# EAGLE schematic G22V2 (EAGLE 9.6.2)
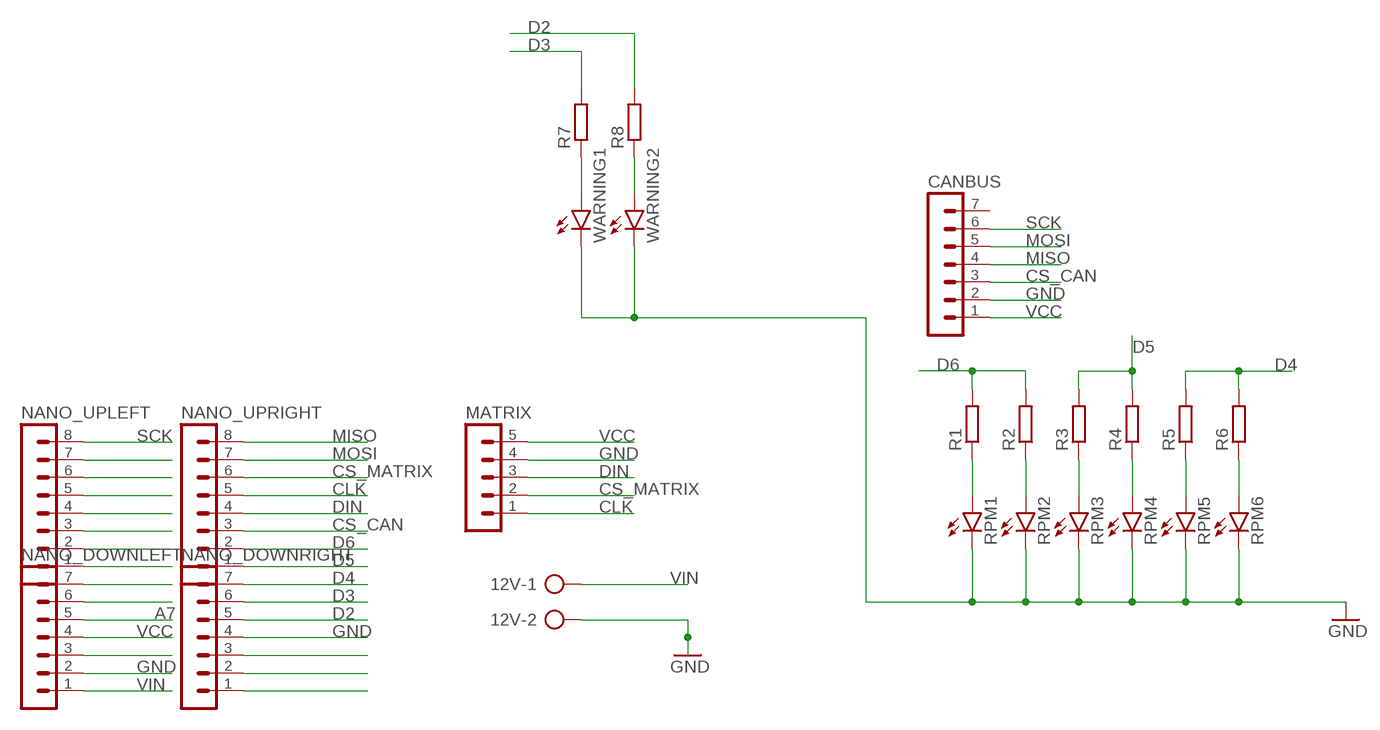
[diagram p0: schematic, sheet 1]

## Parts
12V  AK500/2-H  [AK500/2-H]
CANBUS  MA07-1  [MA07-1]
MATRIX  MA05-1  [MA05-1]
NANO_DOWNLEFT  MA07-1  [MA07-1]
NANO_DOWNRIGHT  MA07-1  [MA07-1]
NANO_UPLEFT  MA08-1  [MA08-1]
NANO_UPRIGHT  MA08-1  [MA08-1]
R1  R-EU_0204/7  [0204/7]
R2  R-EU_0204/7  [0204/7]
R3  R-EU_0204/7  [0204/7]
R4  R-EU_0204/7  [0204/7]
R5  R-EU_0204/7  [0204/7]
R6  R-EU_0204/7  [0204/7]
R7  R-EU_0204/7  [0204/7]
R8  R-EU_0204/7  [0204/7]
RPM1  LED5MM  [LED5MM]
RPM2  LED5MM  [LED5MM]
RPM3  LED5MM  [LED5MM]
RPM4  LED5MM  [LED5MM]
RPM5  LED5MM  [LED5MM]
RPM6  LED5MM  [LED5MM]
WARNING1  LED5MM  [LED5MM]
WARNING2  LED5MM  [LED5MM]

## Nets
A7: NANO_DOWNLEFT.5
CLK: MATRIX.1 NANO_UPRIGHT.5
CS_CAN: CANBUS.3 NANO_UPRIGHT.3
CS_MATRIX: MATRIX.2 NANO_UPRIGHT.6
D2: NANO_DOWNRIGHT.5 R8.2
D3: NANO_DOWNRIGHT.6 R7.2
D4: NANO_DOWNRIGHT.7 R5.2 R6.2
D5: NANO_UPRIGHT.1 R3.2 R4.2
D6: NANO_UPRIGHT.2 R1.2 R2.2
DIN: MATRIX.3 NANO_UPRIGHT.4
GND: 12V.2 CANBUS.2 MATRIX.4 NANO_DOWNLEFT.2 NANO_DOWNRIGHT.4 RPM1.K(C) RPM2.K(C) RPM3.K(C) RPM4.K(C) RPM5.K(C) RPM6.K(C) WARNING1.K(C) WARNING2.K(C)
MISO: CANBUS.4 NANO_UPRIGHT.8
MOSI: CANBUS.5 NANO_UPRIGHT.7
N$4: R7.1 WARNING1.A
N$5: R8.1 WARNING2.A
N$13: NANO_DOWNRIGHT.3
N$14: NANO_DOWNRIGHT.2
N$15: NANO_DOWNRIGHT.1
N$17: NANO_UPLEFT.7
N$18: NANO_UPLEFT.6
N$19: NANO_UPLEFT.5
N$20: NANO_UPLEFT.4
N$21: NANO_UPLEFT.3
N$22: NANO_UPLEFT.2
N$23: NANO_UPLEFT.1
N$24: NANO_DOWNLEFT.7
N$25: NANO_DOWNLEFT.6
N$28: NANO_DOWNLEFT.3
N$29: R1.1 RPM1.A
N$30: R2.1 RPM2.A
N$31: R3.1 RPM3.A
N$32: R4.1 RPM4.A
N$33: R5.1 RPM5.A
N$34: R6.1 RPM6.A
SCK: CANBUS.6 NANO_UPLEFT.8
VCC: CANBUS.1 MATRIX.5 NANO_DOWNLEFT.4
VIN: 12V.1 NANO_DOWNLEFT.1
Unconnected: CANBUS.7

## Library data of the parts
12V = con-ptr500:AK500/2-H: CONNECTOR Aug. 2004 / PTR Meßtechnik: Die Bezeichnung der Serie AK505 wurde geändert. Es handelt sich hierbei um AK500 in horizontaler Ausführung.; OC_FARNELL: unknown; OC_NEWARK: unknown
CANBUS NANO_DOWNLEFT NANO_DOWNRIGHT = con-lstb:MA07-1: PIN HEADER; OC_FARNELL: unknown; OC_NEWARK: unknown
MATRIX = con-lstb:MA05-1: PIN HEADER; OC_FARNELL: unknown; OC_NEWARK: unknown
NANO_UPLEFT NANO_UPRIGHT = con-lstb:MA08-1: PIN HEADER; OC_FARNELL: unknown; OC_NEWARK: unknown
R1-R8 = rcl:R-EU_: RESISTOR, European symbol; SPICEPREFIX: R
RPM1-RPM6 WARNING1 WARNING2 = led:LED: LED OSRAM: - CHIPLED LG R971, LG N971, LY N971, LG Q971, LY Q971, LO R971, LY R971 LH N974, LH R974 LS Q976, LO Q976, LY Q976 LO Q996 - Hyper CHIPLED LW Q18S LB Q993, LB Q99A, LB R99A - SideLED LS A670, LO A670, LY A670, LG A670, LP A670 LB A673, LV A673, LT A673, LW A673 LH A674 LY A675 LS A676, LA A676, LO A676, LY A676, LW A676 LS A679, LY A679, LG A679 - Hyper Micro SIDELED® LS Y876, LA Y876, LO Y876, LY Y876 LT Y87S - SmartLED LW L88C, LW L88S LB L89C, LB L89S, LG L890 LS L89K, LO L89K, LY L89K LS L896, LA L896, LO L896, LY L896 - TOPLED LS T670, LO T670, LY T670, LG T670, LP T670 LSG T670, LSP T670, LSY T670, LOP T670, LYG T670 LG T671, LOG T671, LSG T671 LB T673, LV T673, LT T673, LW T673 LH T674 LS T676, LA T676, LO T676, LY T676, LB T676, LH T676, LSB T676, LW T676 LB T67C, LV T67C, LT T67C, LS T67K, LO T67K, LY T67K, LW E67C LS E67B, LA E67B, LO E67B, LY E67B, LB E67C, LV E67C, LT E67C LW T67C LS T679, LY T679, LG T679 LS T770, LO T770, LY T770, LG T770, LP T770 LB T773, LV T773, LT T773, LW T773 LH T774 LS E675, LA E675, LY E675, LS T675 LS T776, LA T776, LO T776, LY T776, LB T776 LHGB T686 LT T68C, LB T68C - Hyper Mini TOPLED® LB M676 - Mini TOPLED Santana® LG M470 LS M47K, LO M47K, LY M47K Source: http://www.osram.convergy.de LUXEON: - LUMILED® LXK2-PW12-R00, LXK2-PW12-S00, LXK2-PW14-U00, LXK2-PW14-V00 LXK2-PM12-R00, LXK2-PM12-S00, LXK2-PM14-U00 LXK2-PE12-Q00, LXK2-PE12-R00, LXK2-PE12-S00, LXK2-PE14-T00, LXK2-PE14-U00 LXK2-PB12-K00, LXK2-PB12-L00, LXK2-PB12-M00, LXK2-PB14-N00, LXK2-PB14-P00, LXK2-PB14-Q00 LXK2-PR12-L00, LXK2-PR12-M00, LXK2-PR14-Q00, LXK2-PR14-R00 LXK2-PD12-Q00, LXK2-PD12-R00, LXK2-PD12-S00 LXK2-PH12-R00, LXK2-PH12-S00 LXK2-PL12-P00, LXK2-PL12-Q00, LXK2-PL12-R00 Source: www.luxeon.com KINGBRIGHT: KA-3528ASYC Source: www.kingbright.com